# Altium schematic sheet ZYNQ_PS.SchDoc
size 431 x 279 mm
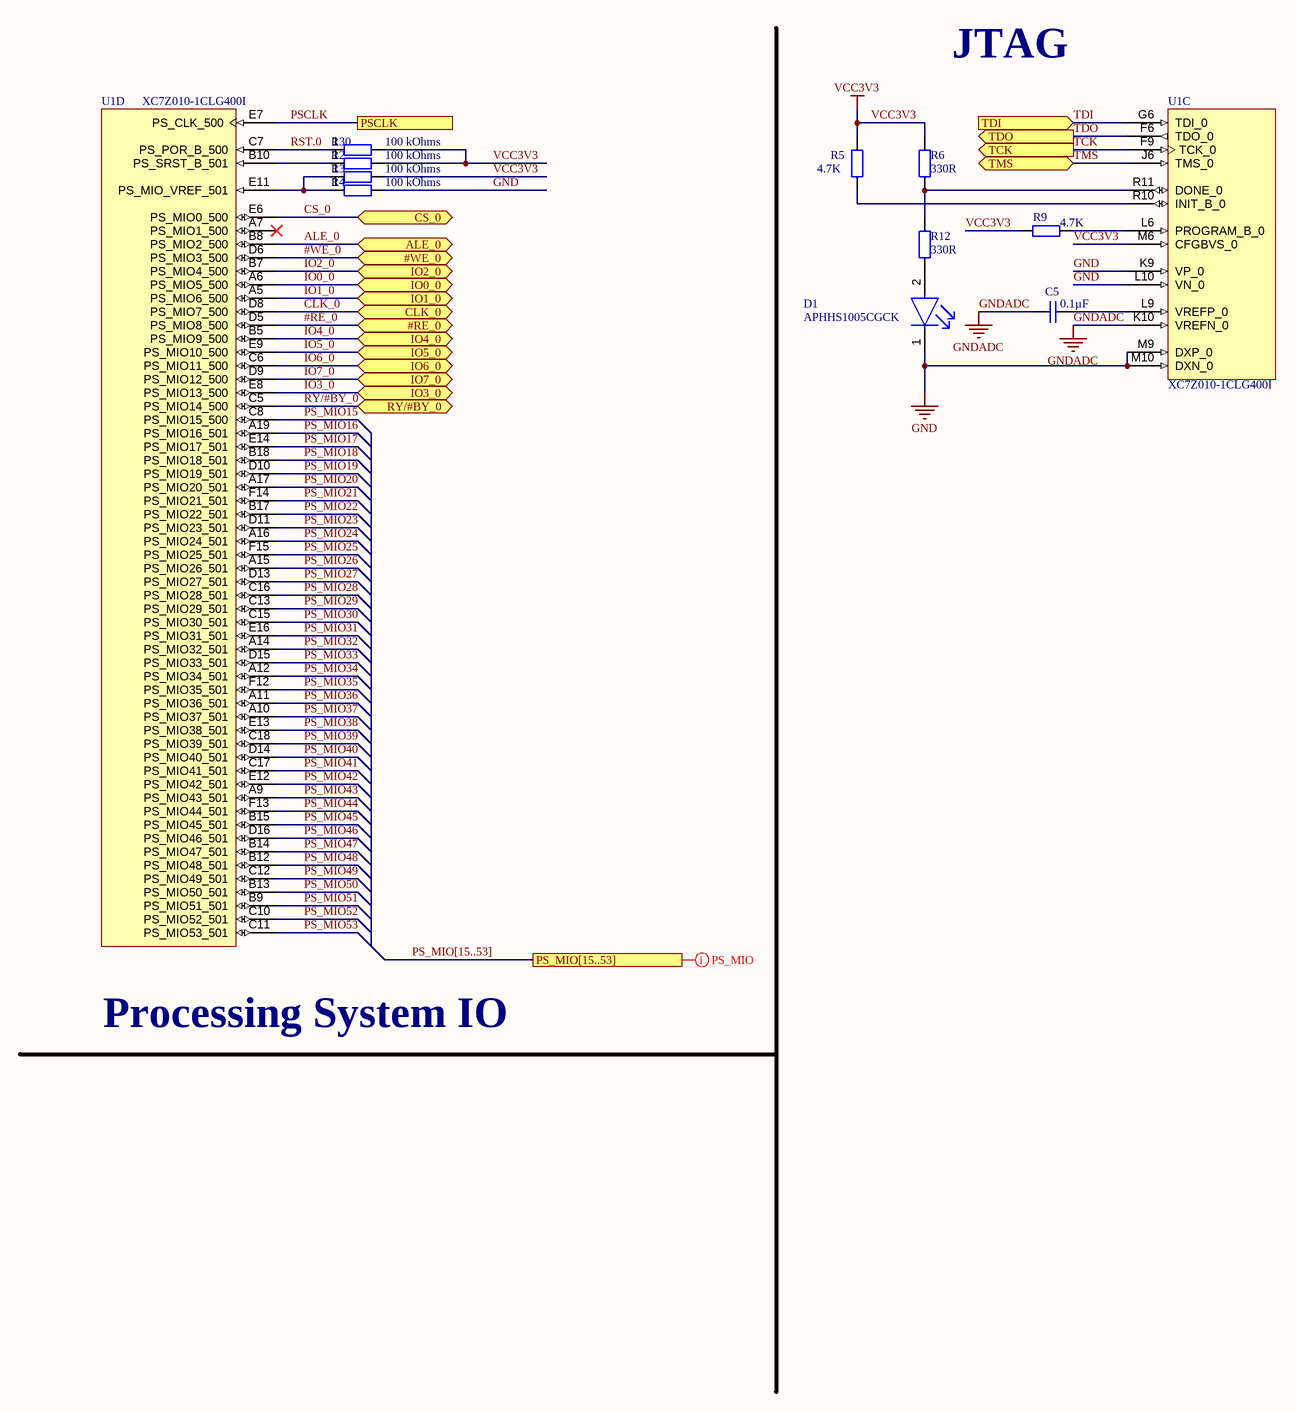
[diagram p0: ZYNQ_PS.SchDoc]

## Parts
C5  0.1µF  [CAP0402i]
D1  APHHS1005CGCK  [FP-APHHS1005CGCK-MFG]
R2  100 kOhms  [RES0402i]
R3  100 kOhms  [RES0402i]
R4  100 kOhms  [RES0402i]
R5  4.7K  [RES0402i]
R6  330R  [RES0402i]
R9  4.7K  [RES0402i]
R12  330R  [RES0402i]
R30  100 kOhms  [RES0402i]
U1  XC7Z010-1CLG400I  [CLG400]  (parts C,D of 9)

## Ports
#RE_0 (bidir), #WE_0 (bidir), ALE_0 (bidir), CLK_0 (bidir), CS_0 (bidir), IO0_0 (bidir), IO1_0 (bidir), IO2_0 (bidir), IO3_0 (bidir), IO4_0 (bidir), IO5_0 (bidir), IO6_0 (bidir), IO7_0 (bidir), PS_MIO[15..53], PSCLK, RY/#BY_0 (bidir), TCK (out), TDI (in), TDO (out), TMS (bidir)

## Nets
GND: D1.1(C) R4.2 U1.K9(VP_0) U1.L10(VN_0) U1.M9(DXP_0) U1.M10(DXN_0)
GNDADC: C5.1 U1.K10(VREFN_0)
VCC3V3: R2.2 R3.2 R5.2 R6.1 R9.1 R30.2 U1.M6(CFGBVS_0)
#RE_0: U1.D5(PS_MIO8_500) ; port #RE_0
#WE_0: U1.D6(PS_MIO3_500) ; port #WE_0
ALE_0: U1.B8(PS_MIO2_500) ; port ALE_0
CLK_0: U1.D8(PS_MIO7_500) ; port CLK_0
CS_0: U1.E6(PS_MIO0_500) ; port CS_0
IO0_0: U1.A6(PS_MIO5_500) ; port IO0_0
IO1_0: U1.A5(PS_MIO6_500) ; port IO1_0
IO2_0: U1.B7(PS_MIO4_500) ; port IO2_0
IO3_0: U1.E8(PS_MIO13_500) ; port IO3_0
IO4_0: U1.B5(PS_MIO9_500) ; port IO4_0
IO5_0: U1.E9(PS_MIO10_500) ; port IO5_0
IO6_0: U1.C6(PS_MIO11_500) ; port IO6_0
IO7_0: U1.D9(PS_MIO12_500) ; port IO7_0
PS_MIO15: U1.C8(PS_MIO15_500)
PS_MIO16: U1.A19(PS_MIO16_501)
PS_MIO17: U1.E14(PS_MIO17_501)
PS_MIO18: U1.B18(PS_MIO18_501)
PS_MIO19: U1.D10(PS_MIO19_501)
PS_MIO20: U1.A17(PS_MIO20_501)
PS_MIO21: U1.F14(PS_MIO21_501)
PS_MIO22: U1.B17(PS_MIO22_501)
PS_MIO23: U1.D11(PS_MIO23_501)
PS_MIO24: U1.A16(PS_MIO24_501)
PS_MIO25: U1.F15(PS_MIO25_501)
PS_MIO26: U1.A15(PS_MIO26_501)
PS_MIO27: U1.D13(PS_MIO27_501)
PS_MIO28: U1.C16(PS_MIO28_501)
PS_MIO29: U1.C13(PS_MIO29_501)
PS_MIO30: U1.C15(PS_MIO30_501)
PS_MIO31: U1.E16(PS_MIO31_501)
PS_MIO32: U1.A14(PS_MIO32_501)
PS_MIO33: U1.D15(PS_MIO33_501)
PS_MIO34: U1.A12(PS_MIO34_501)
PS_MIO35: U1.F12(PS_MIO35_501)
PS_MIO36: U1.A11(PS_MIO36_501)
PS_MIO37: U1.A10(PS_MIO37_501)
PS_MIO38: U1.E13(PS_MIO38_501)
PS_MIO39: U1.C18(PS_MIO39_501)
PS_MIO40: U1.D14(PS_MIO40_501)
PS_MIO41: U1.C17(PS_MIO41_501)
PS_MIO42: U1.E12(PS_MIO42_501)
PS_MIO43: U1.A9(PS_MIO43_501)
PS_MIO44: U1.F13(PS_MIO44_501)
PS_MIO45: U1.B15(PS_MIO45_501)
PS_MIO46: U1.D16(PS_MIO46_501)
PS_MIO47: U1.B14(PS_MIO47_501)
PS_MIO48: U1.B12(PS_MIO48_501)
PS_MIO49: U1.C12(PS_MIO49_501)
PS_MIO50: U1.B13(PS_MIO50_501)
PS_MIO51: U1.B9(PS_MIO51_501)
PS_MIO52: U1.C10(PS_MIO52_501)
PS_MIO53: U1.C11(PS_MIO53_501)
PSCLK: U1.E7(PS_CLK_500) ; port PSCLK
RST.0: R30.1 U1.C7(PS_POR_B_500)
RY/#BY_0: U1.C5(PS_MIO14_500) ; port RY/#BY_0
TCK: U1.F9(TCK_0) ; port TCK
TDI: U1.G6(TDI_0) ; port TDI
TDO: U1.F6(TDO_0) ; port TDO
TMS: U1.J6(TMS_0) ; port TMS
NetC5_2: C5.2 U1.L9(VREFP_0)
NetD1_2: D1.2(A) R12.1
NetR2_1: R2.1 U1.B10(PS_SRST_B_501)
NetR3_1: R3.1 R4.1 U1.E11(PS_MIO_VREF_501)
NetR5_1: R5.1 U1.R10(INIT_B_0)
NetR6_2: R6.2 R12.2 U1.R11(DONE_0)
NetR9_2: R9.2 U1.L6(PROGRAM_B_0)

Not connected (* = marked no-connect by the designer): U1 A7(PS_MIO1_500)*

## Buses and harness runs
bus PS_MIO[15..53] = port PS_MIO[15..53]

## Layout directives
net class PS_MIO; rule Width Constraint [Pref Width = 0.1mm    Min Width = 0.08mm    Max Width = 0.2mm]: (no net found under the mark)

## Notes on the sheet
- JTAG
- Processing System IO
- DWG. NO.
- REV.
- SHT.
- THIS DOCUMENT AND THE DATA DISCLOSED HEREIN OR HEREWITH IS THE PROPERTY OF ALTIUM LIMITED AND MAY BE FREELY DISTRIBUTED IN WHOLE. NO RIGHTS ARE RESERVED OR EXPRESS OR IMPLIED WARANTEE GIVEN.
- REVISION
- DESCRIPTION
- DATE
- APPROVED
- ENG:
- APPROVALS
- PROJECT
- DSN:
- CHK:
- REFERENCE DOCUMENTS
- PROJECT REVISION:
- TITLE
- DOCUMENT REVISION:
- DESIGN ITEM:
- BOM:
- FAB DWG:
- PCB DWG:
- ASSY DWG:
- SCALE:
- SIZE
- B
- CAGE CODE
- FILE NAME
- DWG NO.
- SHEET
- OF
- REV

## Library data of the parts
C5 = Cap_0.1uF_50V_X7R_0402: 0402, 0.1uF, 10%,  50V, X7R; Manufacturer 1: TDK; Manufacturer Part Number 1: C1005X7R1H104K050BE; Type: Ceramic; Value: 0.1µF,50V,X7R; Package: 0402 (1005 Metric); Applications: Automotive; Capacitance: 0.1µF; Component Type: Generic; Mounting Type: SMT; Operating Temperature: -55°C ~ 125°C; Part Number: C1005X7R1H104K050BE; Ratings: AEC-Q200; Supplier 1: Mouser; Supplier 2: DigiKey; Supplier 3: Farnell; Supplier Part Number 1: 810-C1005X7R1H104KBE; Supplier Part Number 2: 445-173610-1-ND; Supplier Part Number 3: 3416071; Temperature Coefficient: X7R; Tolerance: ±10%; Voltage: 50V
D1 = CMP-44529-000044-1: LED GREEN CLEAR CHIP SMD; Viewing Angle: 120°; Dominant Wavelength: 570nm; Test Current: 20mA; Luminous Intensity: 50mcd; Forward Voltage: 2.1V; Number of LEDs: 1; Lens Color: Clear; Packaging: Tape and Reel; Max Operating Temperature: 85°C; Illumination Color: Green; Length: 1mm; Mount: Surface Mount; Lens Style: Clear; Color: Green; Number of Pins: 2; Wavelength: 570nm; Case/Package: 0402; Width: 0.5mm; Package Quantity: 2000; Case Code (Metric): 1005; Height: 0.6mm; Lead Free: Lead Free; Case Code (Imperial): 0402; Forward Current: 20mA; Min Operating Temperature: -40°C
R2-R4 R30 = Res_100K_1%_0402: 0402, 100k, 1%, 62.5mW, 50V; Part Number: CR0402-FX-1003GLF; Manufacturer 1: Bourns; Temperature Coefficient: 100 PPM / C; Package: 0402 (1005 Metric); Voltage: 50 V; Tolerance: ±1%; Operating Temperature: -55°C ~ 125°C; Mounting Type: SMT; Supplier 1: Mouser; Supplier Part Number 1: 652-CR0402FX-1003GLF; Manufacturer Part Number 1: CR0402-FX-1003GLF; Component Type: Generic; Resistance: 100 kOhms; Note: *; Supplier 2: DigiKey; Supplier 3: Farnell; Supplier Part Number 2: CR0402-FX-1003GLFCT-ND; Supplier Part Number 3: 2787798; Value: 100k,1%,62.5mW,50V
R5 R9 = Res_4K7_1%_0402: 0402,4.7K,1%,63mW,50V; Part Number: AC0402FR-074K7L; Manufacturer 1: YAGEO; Alternative Part Number: CR0402-FX-4701GLF; Temperature Coefficient: 100 PPM / C; Value: 4K7,1%,63mW,50V; Package: 0402 (1005 Metric); Voltage: 50V; Tolerance: ±1%; Operating Temperature: -55°C ~ 125°C; Component Type: Generic; Resistance: 4.7K; Note: *; Manufacturer 2: Bourns; Manufacturer Part Number 2: CR0402-FX-4701GLF; Mounting Type: SMT; Manufacturer Part Number 1: AC0402FR-074K7L; Supplier 1: Mouser; Supplier 2: Digi-Key; Supplier 3: Farnell; Supplier 4: Mouser; Supplier 5: Digi-Key; Supplier 6: Farnell; Supplier Part Number 1: 603-AC0402FR-074K7L; Supplier Part Number 2: YAG3497CT-ND; Supplier Part Number 3: 3495205; Supplier Part Number 4: 652-CR0402FX-4701GLF; Supplier Part Number 6: 4014423; Supplier Part Number 5: CR0402-FX-4701GLFCT-ND
R6 R12 = Res_330R_1%_50V_0402: Res Thick Film 0402 330 Ohm 1% 1/16W ±100ppm/°C Molded SMD Paper T/R; Part Number: CRCW0402330RFKED; Manufacturer 1: Vishay; Voltage: 50; Power Rating: 63mW; Voltage Rating: 50V; Value: 330R,1%,1/10W,50V; ComponentLink1Description: https://datasheet.ciiva.com/11821/0900766b80f80784-11821294.pdf?src-supplier=RSComponents; ComponentLink1URL: https://datasheet.ciiva.com/11821/0900766b80f80784-11821294.pdf?src-supplier=RSComponents; Manufacturer Part Number 1: CRCW0402330RFKED; Component Type: Generic; Resistance: 330R; Note: *; ComponentLink2URL: https://datasheet.ciiva.com/7802/aoa0000ce2-7802409.pdf?src-supplier=Element14; ComponentLink2Description: https://datasheet.ciiva.com/7802/aoa0000ce2-7802409.pdf?src-supplier=Element14; ComponentLink3URL: https://datasheet.ciiva.com/22673/1678782-22673685.pdf?src-supplier=Element14; ComponentLink3Description: https://datasheet.ciiva.com/22673/1678782-22673685.pdf?src-supplier=Element14; ComponentLink4URL: https://datasheet.ciiva.com/22687/1678782-22687071.pdf?src-supplier=Element14; ComponentLink4Description: https://datasheet.ciiva.com/22687/1678782-22687071.pdf?src-supplier=Element14; ComponentLink5URL: https://datasheet.ciiva.com/22737/426256-22737285.pdf?src-supplier=Element14; ComponentLink5Description: https://datasheet.ciiva.com/22737/426256-22737285.pdf?src-supplier=Element14; ComponentLink6URL: https://datasheet.ciiva.com/46420/1678782-46420317.pdf?src-supplier=Element14; ComponentLink6Description: https://datasheet.ciiva.com/46420/1678782-46420317.pdf?src-supplier=Element14; ComponentLink7URL: https://datasheet.ciiva.com/24024/aoa0000ce2-24024398.pdf?src-supplier=Mouser; ComponentLink7Description: https://datasheet.ciiva.com/24024/aoa0000ce2-24024398.pdf?src-supplier=Mouser; ComponentLink8URL: https://datasheet.ciiva.com/16784/70260748-16784773.pdf?src-supplier=Allied+Electronics; ComponentLink8Description: https://datasheet.ciiva.com/16784/70260748-16784773.pdf?src-supplier=Allied+Electronics; ComponentLink9URL: https://datasheet.ciiva.com/9190/aoa0000ce2-9190679.pdf?src-supplier=Avnet; ComponentLink9Description: https://datasheet.ciiva.com/9190/aoa0000ce2-9190679.pdf?src-supplier=Avnet; ComponentLink10URL: https://datasheet.ciiva.com/30159/aoa0000ce2-30159014.pdf?src-supplier=Onlinecomponents.com; ComponentLink10Description: https://datasheet.ciiva.com/30159/aoa0000ce2-30159014.pdf?src-supplier=Onlinecomponents.com; Supplier 1: Mouser; Manufacturer: Vishay; Manufacturer Part Number: CRCW0402330RFKED; RoHS: Yes; Category: Chip SMD Resistors; Stock 1: 25067; Pricing 1: 1=0.1, 10=0.042, 50=0.042, 100=0.017, 1000=0.008, 10000=0.005 (USD); Case/Package: 0402; Case Code (Imperial): 0402; Case Code (Metric): 1005; Contact Plating: Tin; Weight: 2.3E-05oz; Min Operating Temperature: -55°C; Max Operating Temperature: 155°C; Packaging: Tape and Reel; Temperature Coefficient: 100ppm/°C; Series: CRCW; Tolerance: 1%; Number of Terminations: 2; Max Power Dissipation: 63mW; Resistor Type: Thick Film; Features: Automotive AEC-Q200; Resistance Tolerance: 1%; Package Quantity: 10; Termination: SMD/SMT; Voltage Rating (DC): 50V; Construction: Rectangular; Technology: THICK FILM; Length: 1mm; Width: 0.02inch; Height: 0.35mm; Depth: 0.5mm; Radiation Hardening: No; RoHS Compliant: Yes; Reach SVHC Compliant: Unknown; Lead Free: Lead Free; Military Standard: Not; ComponentLink11URL: https://datasheet.ciiva.com/11811/0900766b80d98824-11811100.pdf?src-supplier=Rs; ComponentLink11Description: https://datasheet.ciiva.com/11811/0900766b80d98824-11811100.pdf?src-supplier=Rs; ComponentLink12URL: https://datasheet.ciiva.com/7777/1697337-7777541.pdf?src-supplier=Element14; ComponentLink12Description: https://datasheet.ciiva.com/7777/1697337-7777541.pdf?src-supplier=Element14; ComponentLink13URL: https://datasheet.ciiva.com/7777/1697337-7777542.pdf?src-supplier=Element14; ComponentLink13Description: https://datasheet.ciiva.com/7777/1697337-7777542.pdf?src-supplier=Element14; ComponentLink14URL: https://datasheet.ciiva.com/2463/dcrcwe3-2463479.pdf?src-supplier=Digi-Key; ComponentLink14Description: https://datasheet.ciiva.com/2463/dcrcwe3-2463479.pdf?src-supplier=Digi-Key; ComponentLink15URL: https://datasheet.ciiva.com/2463/dcrcwe3-2463480.pdf?src-supplier=Digi-Key; ComponentLink15Description: https://datasheet.ciiva.com/2463/dcrcwe3-2463480.pdf?src-supplier=Digi-Key; ComponentLink16URL: https://datasheet.ciiva.com/2463/dcrcwe3-2463478.pdf?src-supplier=Digi-Key; ComponentLink16Description: https://datasheet.ciiva.com/2463/dcrcwe3-2463478.pdf?src-supplier=Digi-Key; ComponentLink17URL: https://datasheet.ciiva.com/16772/70201119-16772762.pdf?src-supplier=Allied+Electronics; ComponentLink17Description: https://datasheet.ciiva.com/16772/70201119-16772762.pdf?src-supplier=Allied+Electronics; ComponentLink18URL: https://datasheet.ciiva.com/5549/dcrcwe3-109170-5549013.pdf?src-supplier=Mouser; ComponentLink18Description: https://datasheet.ciiva.com/5549/dcrcwe3-109170-5549013.pdf?src-supplier=Mouser; ComponentLink19URL: https://datasheet.ciiva.com/16429/dcrcwe3-16429993.pdf?src-supplier=Future+Electronics; ComponentLink19Description: https://datasheet.ciiva.com/16429/dcrcwe3-16429993.pdf?src-supplier=Future+Electronics; ComponentLink20URL: https://datasheet.ciiva.com/3256/dcrcwe3-3256405.pdf?src-supplier=Avnet; ComponentLink20Description: https://datasheet.ciiva.com/3256/dcrcwe3-3256405.pdf?src-supplier=Avnet; Supplier 2: Digi-Key; Stock 2: 134870; Pricing 2: 1=0.1, 10=0.037, 100=0.0149, 1000=0.00668, 2500=0.0058, 5000=0.00479 (USD); Supplier 3: Farnell; Stock 3: 164855; Pricing 3: 10=0.0395, 100=0.016, 500=0.0075, 2500=0.0066, 5000=0.0056, 10000=0.0047, 50000=0.0046, 100000=0.0045 (EUR); Supplier Part Number 1: 71-CRCW0402-330-E3; Supplier Part Number 2: 541-330LCT-ND; Supplier Part Number 3: 1469709
U1 = XC7Z010-1CLG400I: 667 MHz Zynq?7000 AP SoC, 130 PS I/O, 100 FPGA I/O, 400-Ball BGA, Speed Grade 1, Industrial Grade, Pb-Free; Manufacturer: Xilinx; Extensible Block RAM (# 36Kb Blocks): 240 KB (60); Flip Flops: 35200; LUTs: 17600; Speed Grade: -1; DatasheetVersion: v1.2; PackageVersion: Rev 1.1; PackageReference: CLG400; PackageDescription: Wire-Bond Chip-Scale BGA, Body 17 x 17 mm, 0.8 mm Pitch; Generic Part Number: XC7Z010; RoHS: Pb-Free; Mounting Technology: Surface Mount; Code_JEDEC: MO-275-MMAA-1; PartNumber: XC7Z010-1CLG400I; ComponentLink1Description: Datasheet; ComponentLink1URL: http://www.xilinx.com/support/documentation/data_sheets/ds190-Zynq-7000-Overview.pdf; ComponentLink2Description: Package Specification; ComponentLink2URL: http://www.xilinx.com/support/documentation/user_guides/ug865-Zynq-7000-Pkg-Pinout.pdf; ComponentLink3Description: DC and AC Switching Characteristics; ComponentLink3URL: http://www.xilinx.com/support/documentation/data_sheets/ds187-XC7Z010-XC7Z020-Data-Sheet.pdf; ComponentLink4Description: Package File; ComponentLink4URL: http://www.xilinx.com/support/packagefiles/z7packages/xc7z010clg400pkg.txt; ComponentLink5Description: Packaging and Pinout; ComponentLink5URL: http://www.xilinx.com/support/documentation/user_guides/ug865-Zynq-7000-Pkg-Pinout.pdf; ComponentLink6Description: PCB and Layout Guide; ComponentLink6URL: http://www.xilinx.com/support/documentation/user_guides/ug483_7Series_PCB.pdf